# Altium schematic sheet power.SchDoc: Control Plane
size Letter; Author: Ye-Sheng Kuo; Revision: 2; SheetNumber: 2; SheetTotal: 8
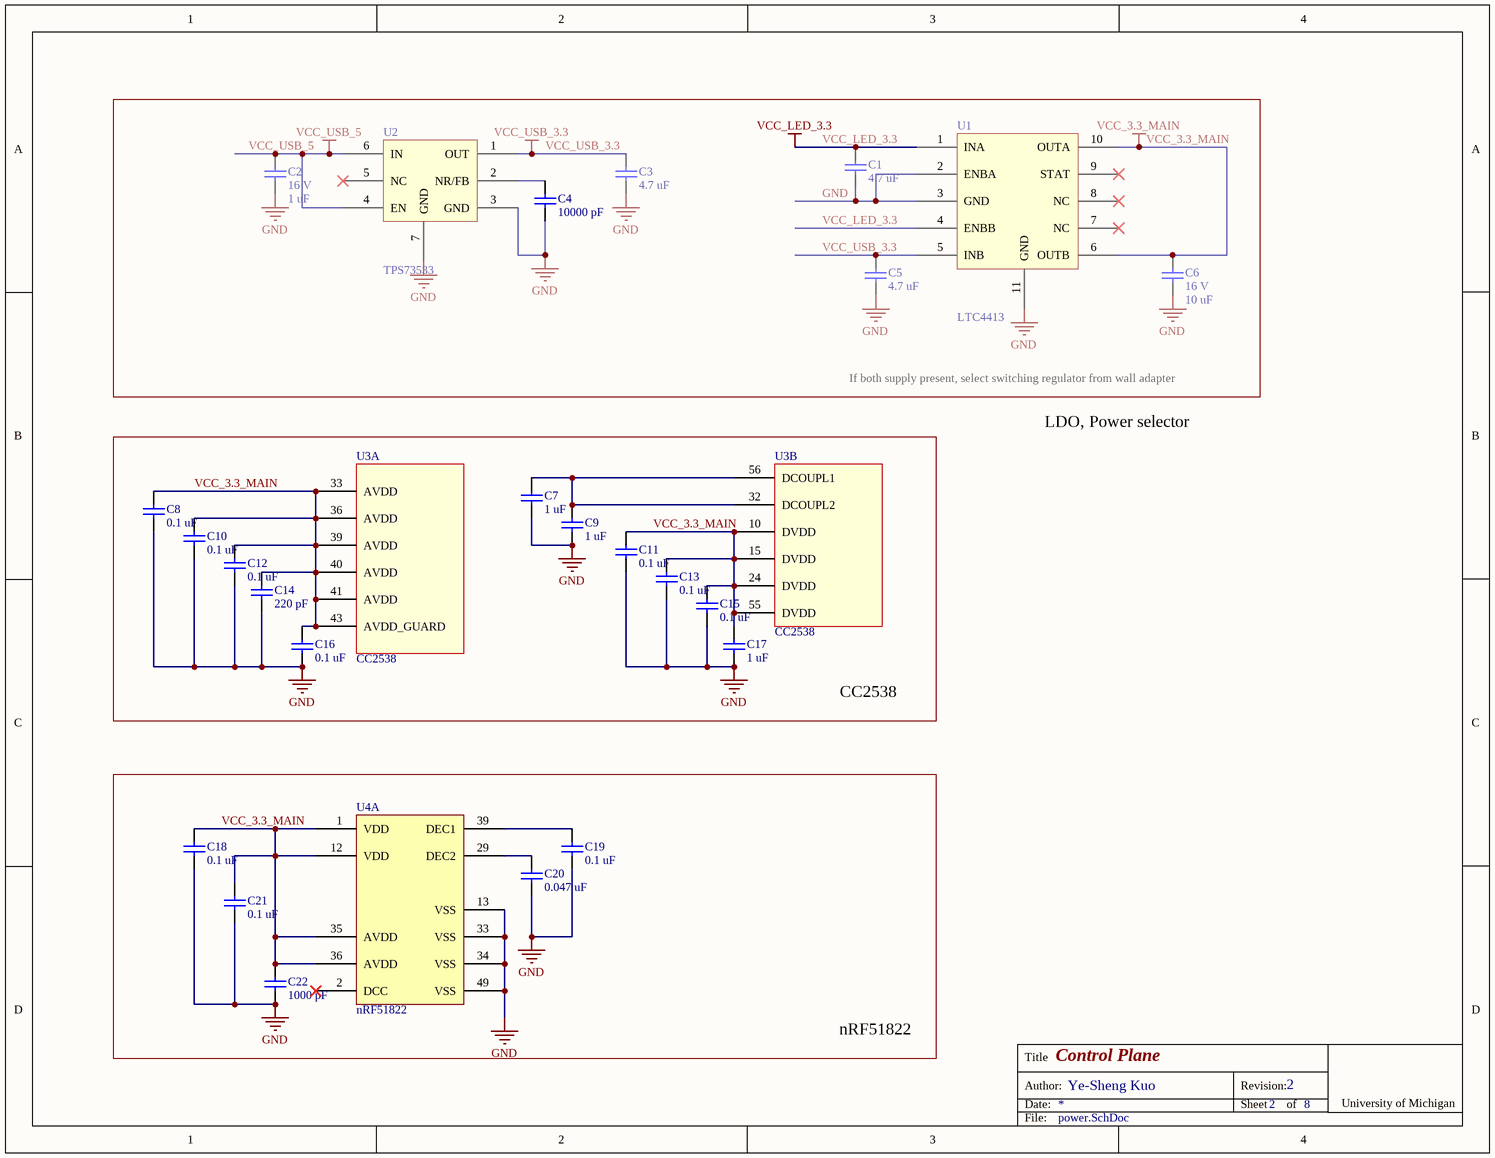
[diagram p0: power.SchDoc]

## Parts
C1  value 4.7 uF  [0603]  (hidden comment: Ceramic capacitor)
C2  value 1 uF  voltage rated: 16 V  [0603]  (hidden comment: Ceramic capacitor)
C3  value 4.7 uF  [0603]  (hidden comment: Ceramic capacitor)
C4  value 10000 pF  [0402]  (hidden comment: Ceramic capacitor)
C5  value 4.7 uF  [0603]  (hidden comment: Ceramic capacitor)
C6  value 10 uF  voltage rated: 16 V  [0603]  (hidden comment: Ceramic capacitor)
C7  value 1 uF  [0402]  (hidden comment: Ceramic capacitor)
C8  value 0.1 uF  [0402]  (hidden comment: Ceramic capacitor)
C9  value 1 uF  [0402]  (hidden comment: Ceramic capacitor)
C10  value 0.1 uF  [0402]  (hidden comment: Ceramic capacitor)
C11  value 0.1 uF  [0402]  (hidden comment: Ceramic capacitor)
C12  value 0.1 uF  [0402]  (hidden comment: Ceramic capacitor)
C13  value 0.1 uF  [0402]  (hidden comment: Ceramic capacitor)
C14  value 220 pF  [0402]  (hidden comment: Ceramic capacitor)
C15  value 0.1 uF  [0402]  (hidden comment: Ceramic capacitor)
C16  value 0.1 uF  [0402]  (hidden comment: Ceramic capacitor)
C17  value 1 uF  [0402]  (hidden comment: Ceramic capacitor)
C18  value 0.1 uF  [0402]  (hidden comment: Ceramic capacitor)
C19  value 0.1 uF  [0402]  (hidden comment: Ceramic capacitor)
C20  value 0.047 uF  [0402]  (hidden comment: Ceramic capacitor)
C21  value 0.1 uF  [0402]  (hidden comment: Ceramic capacitor)
C22  value 1000 pF  [0402]  (hidden comment: Ceramic capacitor)
U1  LTC4413  [DFN-10]
U2  TPS73533  [SON-6]
U3  CC2538  [QFN56]  (parts A,B of 6)
U4  nRF51822  [QFN-48]  (part A of 5)

## Nets
GND: C1.2 C2.2 C3.2 C4.2 C5.2 C6.2 C7.2 C8.2 C9.2 C10.2 C11.2 C12.2 C13.2 C14.2 C15.2 C16.2 C17.2 C18.2 C19.2 C20.2 C21.2 C22.2 U1.2(ENBA) U1.3(GND) U1.11(GND) U2.3(GND) U2.7(GND) U4.13(VSS) U4.33(VSS) U4.34(VSS) U4.49(VSS)
VCC_3.3_MAIN: C6.1 C8.1 C10.1 C11.1 C12.1 C13.1 C14.1 C15.1 C16.1 C17.1 C18.1 C21.1 C22.1 U1.6(OUTB) U1.10(OUTA) U3.10(DVDD) U3.15(DVDD) U3.24(DVDD) U3.33(AVDD) U3.36(AVDD) U3.39(AVDD) U3.40(AVDD) U3.41(AVDD) U3.43(AVDD_GUARD) U3.55(DVDD) U4.1(VDD) U4.12(VDD) U4.35(AVDD) U4.36(AVDD)
VCC_LED_3.3: C1.1 U1.1(INA) U1.4(ENBB)
VCC_USB_3.3: C3.1 C5.1 U1.5(INB) U2.1(OUT)
VCC_USB_5: C2.1 U2.4(EN) U2.6(IN)
NetC4_1: C4.1 U2.2(NR/FB)
NetC7_1: C7.1 C9.1 U3.32(DCOUPL2) U3.56(DCOUPL1)
NetC19_1: C19.1 U4.39(DEC1)
NetC20_1: C20.1 U4.29(DEC2)

Not connected (* = marked no-connect by the designer): U1 7(NC)* 8(NC)* 9(STAT)*; U2 5(NC)*; U4 2(DCC)*

## Notes on the sheet
- If both supply present, select switching regulator from wall adapter
- LDO, Power selector
- CC2538
- nRF51822
- Title
- Date:
- Author:
- Revision:
- Sheet
- of
- University of Michigan
- File:

## Library data of the parts
C1 C3 C5 = C_4.7u_10V_0603_ceramic: Ceramic capacitor, 4.7u, 10V, 0603 package; Manufacture: TDK; tolerance: 20%; Temp rating: X5R; package: 0603; voltage rated: 10 V; Supplier 1: Digi-Key; Supplier Part Number 1: 445-7482-1-ND
C2 = C_1u_16V_0603_ceramic: Ceramic capacitor, 1 uF, 16 V, 0603 package; Manufacture: TDK; tolerance: 10%; package: 0603; Supplier 1: Digi-Key; Supplier Part Number 1: 445-1604-1-ND
C4 = C_10000p_16V_0402_ceramic: Ceramic capacitor, 10000 pF, 16 V, 0402 package; Manufacture: Murata; voltage rated: 16 V; tolerance: 10%; Temperature Coefficient: X7R; package: 0402; Supplier 1: Digi-Key; Supplier Part Number 1: 490-1313-1-ND
C6 = C_10u_16V_0603_ceramic: Ceramic capacitor, 10 uF, 16 V, 0603 package; Manufacture: TDK; tolerance: 20%; Temperature Coefficient: X5R; package: 0603; Supplier 1: Digi-Key; Supplier Part Number 1: 445-9065-6-ND
C7 C9 C17 = C_1u_16V_0402_ceramic: Ceramic capacitor, 1 uF, 16V, 0402 package; Manufacture: TDK; tolerance: 10%; Temperature rating: X5R; voltage rated: 16 V; package: 0402; Supplier 1: Digi-Key; Supplier Part Number 1: 445-4978-1-ND
C8 C10-C13 C15 C16 C18 C19 C21 = C_0.1u_10V_0402_ceramic: Ceramic capacitor, 0.1u, 0402 package; Manufacture: TDK; voltage rated: 10 V; tolerance: 10%; Supplier 1: Digi-Key; Supplier Part Number 1: 445-1265-1-ND; package: 0402
C14 = C_220p_50V_0402_ceramic: Ceramic capacitor, 220 pF, 0402 package; Manufacture: Johanson; voltage rated: 50 V; tolerance: 10%; package: 0402; Temperature: X7R; Supplier 1: Digi-Key; Supplier Part Number 1: 445-1254-1-ND
C20 = C_0.047u_16V_0402_ceramic: Ceramic capacitor, 0.047u, 16V, 0402 package; Manufacture: TDK; tolerance: 10%; Temperature rating: X7R; voltage rated: 16 V; package: 0402; Supplier 1: Digi-Key; Supplier Part Number 1: 445-1264-1-ND
C22 = C_1000p_50V_0402_ceramic: Ceramic capacitor, 1000 pF, 0402 package; Manufacture: TDK; voltage rated: 50 V; tolerance: 10%; package: 0402; Supplier 1: Digi-Key; Supplier Part Number 1: 445-6846-1-ND
U1 = LTC4413: Dual 2.6A, 2.5V to 5.5V,  Ideal Diodes in 3mm × 3mm DFN; Supplier 1: Digi-Key; Supplier Part Number 1: LTC4413EDD#TRPBFCT-ND
U2 = TPS73533: 500mA, Low Quiescent Current, Ultra-Low Noise, High PSRR  Low-Dropout Linear Regulator; Supplier 1: Digi-Key; Supplier Part Number 1: 296-24289-1-ND
U3 = CC2538: A Powerful System-On-Chip for 2.4-GHz IEEE 802.15.4, 6LoWPAN  and ZigBee Applications; Supplier 1: Digi-Key; Supplier Part Number 1: 296-35797-1-ND
U4 = nRF51822: Multiprotocol Bluetooth® low energy/2.4 GHz RF System on Chip; Supplier 1: Digi-Key; Supplier Part Number 1: 1490-1032-1-ND